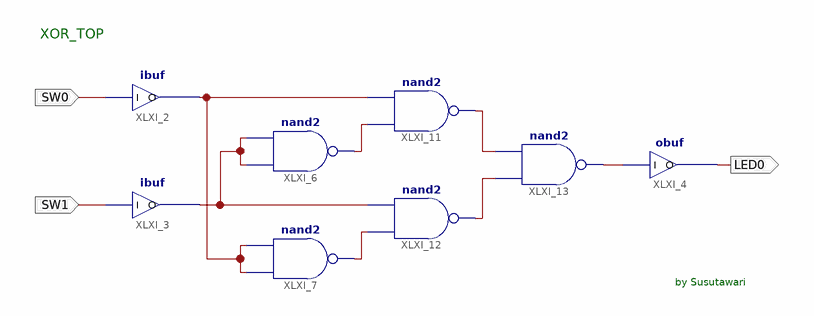
[diagram p0: schematic sheet 1]
// Xilinx ISE schematic XOR_TOP.sch (spartan3e) as structural Verilog: 8 symbols, 3 ports
module XOR_TOP (
  input  SW0,
  input  SW1,
  output LED0
);

  wire XLXN_10, XLXN_15, XLXN_21, XLXN_22, XLXN_25, XLXN_26, XLXN_27;

  ibuf XLXI_2 (.I(SW0), .O(XLXN_22));
  nand XLXI_6 (XLXN_10, XLXN_21, XLXN_21);
  nand XLXI_11 (XLXN_26, XLXN_10, XLXN_22);
  ibuf XLXI_3 (.I(SW1), .O(XLXN_21));
  obuf XLXI_4 (.I(XLXN_25), .O(LED0));
  nand XLXI_13 (XLXN_25, XLXN_27, XLXN_26);
  nand XLXI_12 (XLXN_27, XLXN_15, XLXN_21);
  nand XLXI_7 (XLXN_15, XLXN_22, XLXN_22);

  // Notes on the sheet:
  //   XOR_TOP
  //   by Susutawari
endmodule
